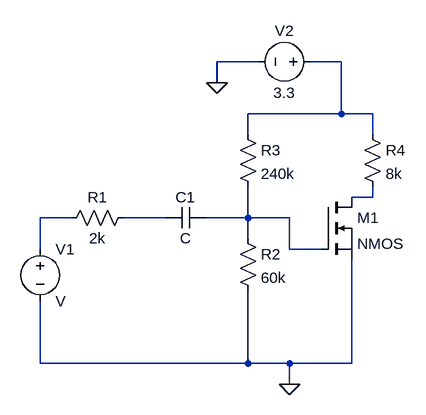
[diagram p0: schematic MOSFET_analysis.asc]
MOSFET_analysis.asc, the LTspice schematic file:
Version 4
SHEET 1 880 680
WIRE 272 -160 208 -160
WIRE 400 -160 352 -160
WIRE 208 -128 208 -160
WIRE 400 -80 400 -160
WIRE 400 -80 256 -80
WIRE 448 -80 400 -80
WIRE 256 -48 256 -80
WIRE 448 -48 448 -80
WIRE 448 48 448 32
WIRE 448 48 416 48
WIRE -16 80 -64 80
WIRE 128 80 64 80
WIRE 256 80 256 32
WIRE 256 80 192 80
WIRE 320 80 256 80
WIRE 256 112 256 80
WIRE -64 128 -64 80
WIRE 320 128 320 80
WIRE 368 128 320 128
WIRE -64 304 -64 208
WIRE 256 304 256 192
WIRE 256 304 -64 304
WIRE 320 304 256 304
WIRE 416 304 416 144
WIRE 416 304 320 304
WIRE 320 336 320 304
FLAG 320 336 0
FLAG 208 -128 0
SYMBOL voltage -64 112 R0
SYMATTR InstName V1
SYMBOL res 80 64 R90
WINDOW 0 0 56 VBottom 2
WINDOW 3 32 56 VTop 2
SYMATTR InstName R1
SYMATTR Value 2k
SYMBOL cap 192 64 R90
WINDOW 0 0 32 VBottom 2
WINDOW 3 32 32 VTop 2
SYMATTR InstName C1
SYMBOL res 240 96 R0
SYMATTR InstName R2
SYMATTR Value 60k
SYMBOL res 240 -64 R0
SYMATTR InstName R3
SYMATTR Value 240k
SYMBOL voltage 368 -160 R90
WINDOW 0 -32 56 VBottom 2
WINDOW 3 32 56 VTop 2
WINDOW 123 0 0 Left 0
WINDOW 39 0 0 Left 0
SYMATTR InstName V2
SYMATTR Value 3.3
SYMBOL res 432 -64 R0
SYMATTR InstName R4
SYMATTR Value 8k
SYMBOL nmos 368 48 R0
SYMATTR InstName M1

The netlist it stands for:
* MOSFET_analysis.asc
V1 N003 0 V
R1 N004 N003 2k
C1 N005 N004 C
R2 N005 0 60k
R3 N001 N005 240k
V2 N001 0 3.3
R4 N001 N002 8k
M1 N002 N005 0 0 NMOS
.model NMOS NMOS
.model PMOS PMOS
.lib standard.mos
.backanno
.end